# EAGLE design master-v12_36V (EAGLE 7.1.0)
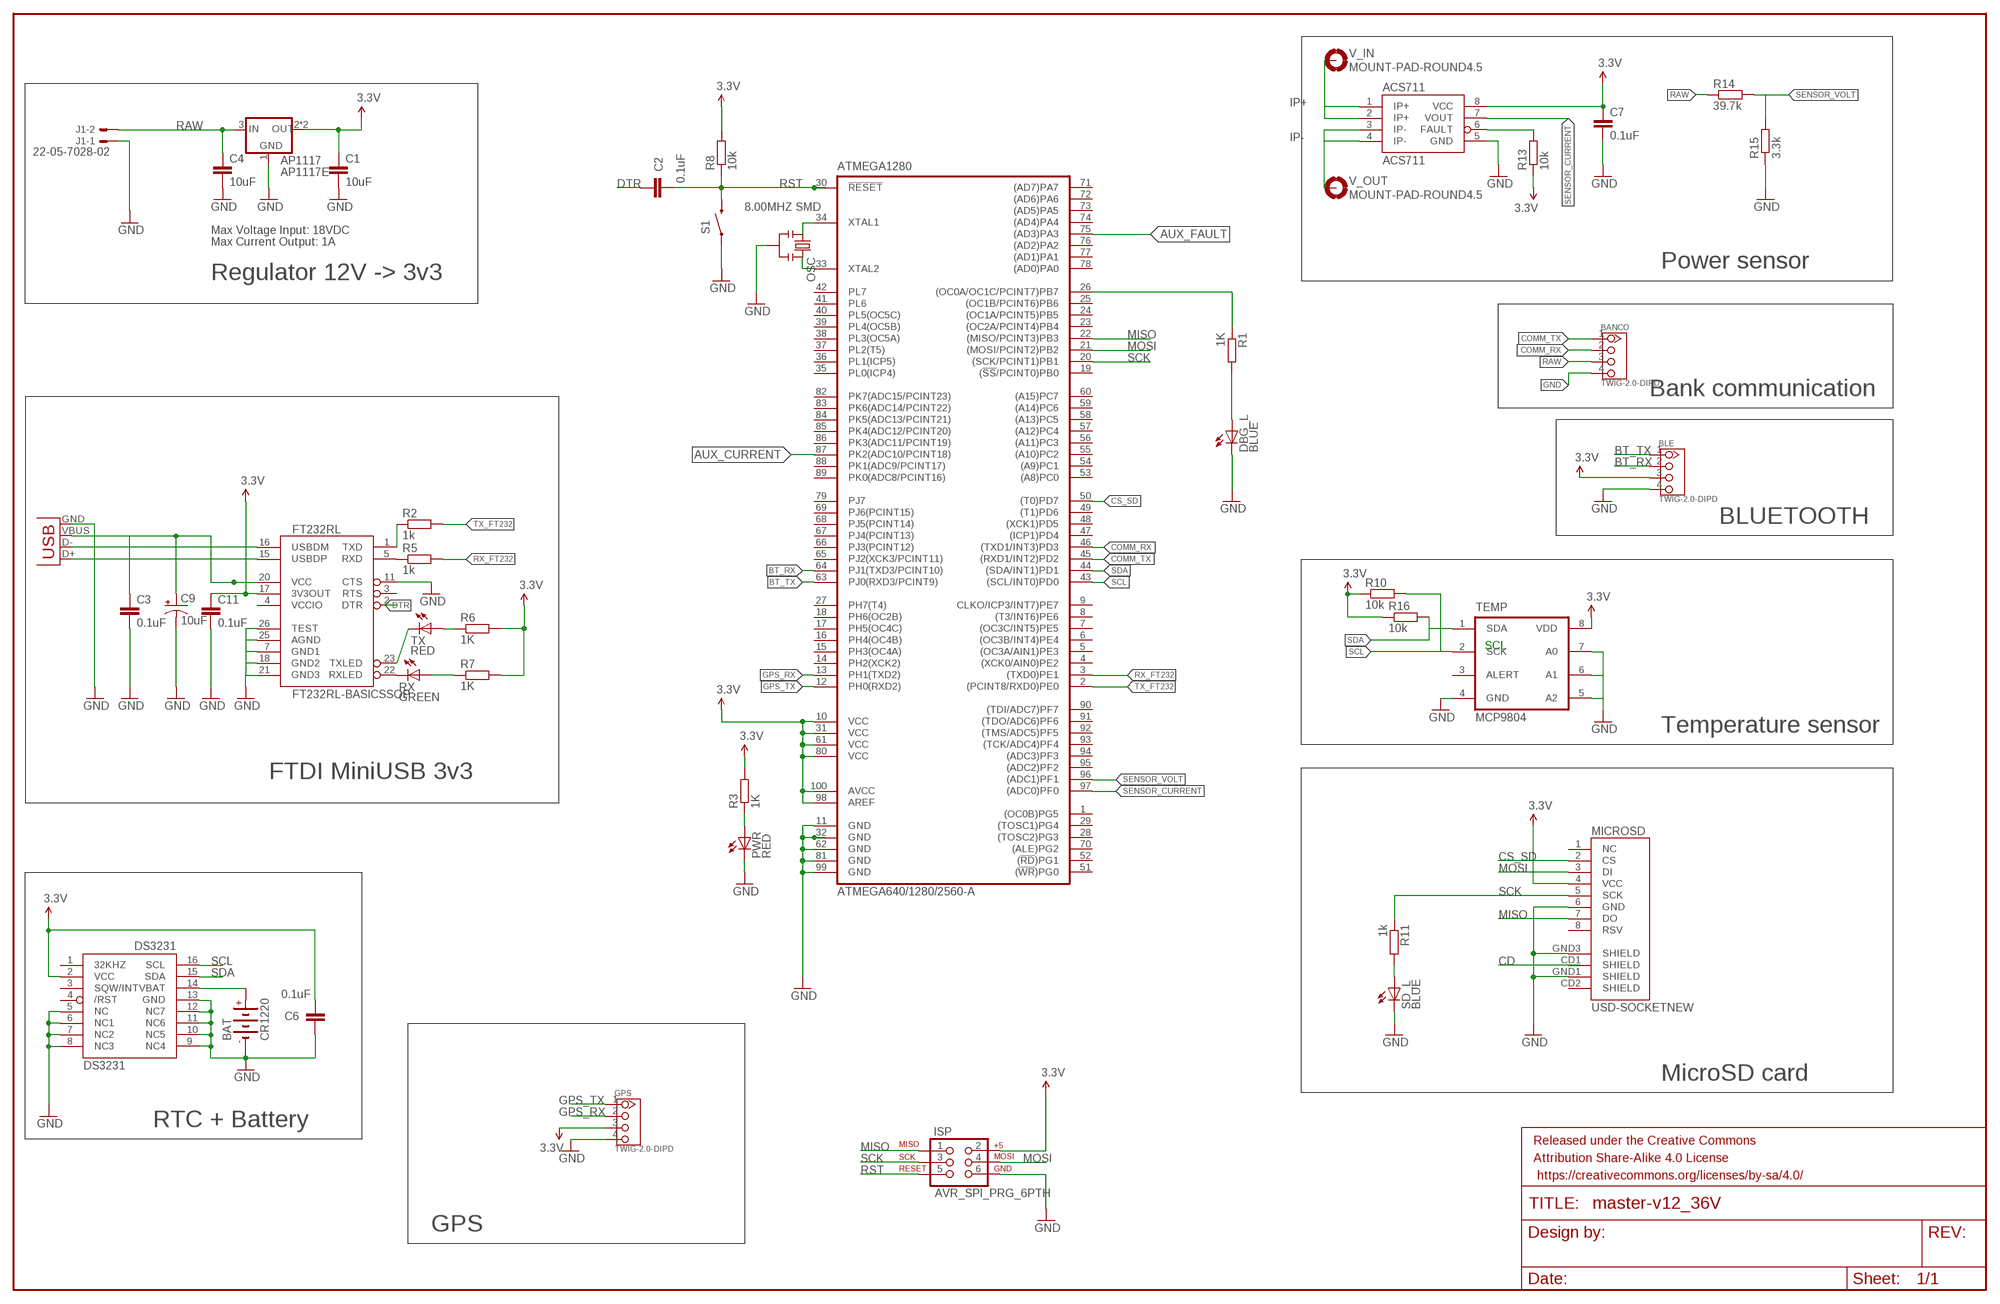
[diagram p0: schematic, sheet 1]

## Parts
ACS711  ACS711  [SOIC8]
AP1117  AP1117E  [SOT223]
ATMEGA1280  ATMEGA640/1280/2560-A  [TQFP100A]
BANCO  TWIG-2.0-DIPD  [2.0_1X4_90]
BAT  CR1220  [CR1220]
BLE  TWIG-2.0-DIPD  [2.0_1X4_90]
C1  10uF  C-EUC0805K  [C0805K]
C2  0.1uF  C-EUC0805K  [C0805K]
C3  0.1uF  CAP0402-CAP  [0402-CAP]
C4  10uF  C-EUC0805K  [C0805K]
C6  0.1uF  C-EUC0805K  [C0805K]
C7  0.1uF  C-EUC0805K  [C0805K]
C9  10uF  CAP_POL1206  [EIA3216]
C11  0.1uF  CAP0402-CAP  [0402-CAP]
DBG_L  BLUE  LEDCHIPLED_0805  [CHIPLED_0805]
DS3231  DS3231/SO  [SO16W]
FRAME1  FRAME-LEDGER  [CREATIVE_COMMONS]
FT232RL  FT232RL-BASICSSOP  [SSOP28DB]
GPS  TWIG-2.0-DIPD  [2.0_1X4_90]
ISP  AVR_SPI_PRG_6PTH  [2X3]
J1  22-05-7028-02  [7395-02]
MICROSD  USD-SOCKETNEW  [MICRO-SD-SOCKET-PP]
OSC  8.00MHZ SMD  RESONATOR-SMD  [RESONATOR-SMD]
PWR  RED  LEDCHIPLED_0805  [CHIPLED_0805]
R1  1K  R-EU_R0805  [R0805]
R2  1k  R-EU_R0805  [R0805]
R3  1K  R-EU_R0805  [R0805]
R5  1k  R-EU_R0805  [R0805]
R6  1K  R-EU_R0805  [R0805]
R7  1K  R-EU_R0805  [R0805]
R8  10k  R-EU_R0805  [R0805]
R10  10k  R-EU_R0805  [R0805]
R11  1k  R-EU_R0805  [R0805]
R13  10k  R-EU_R0805  [R0805]
R14  39.7k  R-EU_R0805  [R0805]
R15  3.3k  R-EU_R0805  [R0805]
R16  10k  R-EU_R0805  [R0805]
RX  GREEN  LEDCHIPLED_0805  [CHIPLED_0805]
S1  SWITCH-MOMENTARY-2-SMD-1101NE  [TACTILE-SWITCH-1101NE]
SD_L  BLUE  LEDCHIPLED_0805  [CHIPLED_0805]
TEMP  MCP9804  [MSOP8]
TX  RED  LEDCHIPLED_0805  [CHIPLED_0805]
V_IN  MOUNT-PAD-ROUND4.5  [4,5-PAD]
V_OUT  MOUNT-PAD-ROUND4.5  [4,5-PAD]
X1  USB-MB-H  [USB-MB-H]

## Nets
3.3V: ACS711.8(VCC) AP1117.2(OUT) AP1117.4(OUT) ATMEGA1280.10(VCC) ATMEGA1280.31(VCC) ATMEGA1280.61(VCC) ATMEGA1280.80(VCC) ATMEGA1280.98(AREF) ATMEGA1280.100(AVCC) BLE.3 C1.1 C6.1 C7.1 C11.1 DS3231.2(VCC) FT232RL.17(3V3OUT) GPS.3 ISP.2 MICROSD.4(VCC) R3.2 R6.2 R7.2 R8.2 R10.1 R13.1 R16.1 TEMP.8(VDD)
AUX_CURRENT: ATMEGA1280.87(PK2(ADC10/PCINT18))
AUX_FAULT: ATMEGA1280.75((AD3)PA3)
BT_RX: ATMEGA1280.64(PJ1(TXD3/PCINT10)) BLE.2
BT_TX: ATMEGA1280.63(PJ0(RXD3/PCINT9)) BLE.1
COMM_RX: ATMEGA1280.46((TXD1/INT3)PD3) BANCO.2
COMM_TX: ATMEGA1280.45((RXD1/INT2)PD2) BANCO.1
CS_SD: ATMEGA1280.50((T0)PD7) MICROSD.2(CS)
DTR: C2.2 FT232RL.2(DTR)
GND [power]: ACS711.5(GND) AP1117.1(GND) ATMEGA1280.11(GND) ATMEGA1280.32(GND) ATMEGA1280.62(GND) ATMEGA1280.81(GND) ATMEGA1280.99(GND) BANCO.4 BAT.- BLE.4 C1.2 C3.2 C4.2 C6.2 C7.2 C9.C(-) C11.2 DBG_L.C DS3231.5(NC) DS3231.6(NC1) DS3231.7(NC2) DS3231.8(NC3) DS3231.9(NC4) DS3231.10(NC5) DS3231.11(NC6) DS3231.12(NC7) DS3231.13(GND) FT232RL.7(GND1) FT232RL.11(CTS) FT232RL.18(GND2) FT232RL.21(GND3) FT232RL.25(AGND) FT232RL.26(TEST) GPS.4 ISP.6 J1.1 MICROSD.6(GND) MICROSD.GND1(SHIELD) MICROSD.GND3(SHIELD) OSC.2 PWR.C R15.1 S1.P$1 SD_L.C TEMP.4(GND) TEMP.5(A2) TEMP.6(A1) TEMP.7(A0) X1.GND
GPS_RX: ATMEGA1280.13(PH1(TXD2)) GPS.2
GPS_TX: ATMEGA1280.12(PH0(RXD2)) GPS.1
IP+: ACS711.1(IP+) ACS711.2(IP+) V_IN.B4,5(MOUNT)
IP-: ACS711.3(IP-) ACS711.4(IP-) V_OUT.B4,5(MOUNT)
MISO: ATMEGA1280.22((MISO/PCINT3)PB3) ISP.1 MICROSD.7(DO)
MOSI: ATMEGA1280.21((MOSI/PCINT2)PB2) ISP.4 MICROSD.3(DI)
N$1: BAT.+ DS3231.14(VBAT)
N$2: ATMEGA1280.34(XTAL1) OSC.1
N$3: DBG_L.A R1.2
N$4: ATMEGA1280.26((OC0A/OC1C/PCINT7)PB7) R1.1
N$6: FT232RL.1(TXD) R2.1
N$7: PWR.A R3.1
N$8: FT232RL.5(RXD) R5.1
N$10: FT232RL.22(RXLED) RX.C
N$11: R7.1 RX.A
N$12: FT232RL.23(TXLED) TX.C
N$13: R6.1 TX.A
N$14: ATMEGA1280.33(XTAL2) OSC.3
N$23: R11.2 SD_L.A
N$69: ACS711.6(FAULT) R13.2
RAW [power]: AP1117.3(IN) BANCO.3 C4.1 J1.2 R14.1
RST: ATMEGA1280.30(!RESET!) C2.1 ISP.5 R8.1 S1.P$2
RX_FT232: ATMEGA1280.3((TXD0)PE1) R5.2
SCK: ATMEGA1280.20((SCK/PCINT1)PB1) ISP.3 MICROSD.5(SCK) R11.1
SCL: ATMEGA1280.43((SCL/INT0)PD0) DS3231.16(SCL) R10.2 TEMP.2(SCK)
SDA: ATMEGA1280.44((SDA/INT1)PD1) DS3231.15(SDA) R16.2 TEMP.1(SDA)
SENSOR_CURRENT: ACS711.7(VOUT) ATMEGA1280.97((ADC0)PF0)
SENSOR_VOLT: ATMEGA1280.96((ADC1)PF1) R14.2 R15.2
TX_FT232: ATMEGA1280.2((PCINT8/RXD0)PE0) R2.2
USB_D+1: FT232RL.15(USBDP) X1.D+
USB_D-1: FT232RL.16(USBDM) X1.D-
VCC1 [power]: C3.1 C9.A(+) FT232RL.20(VCC) X1.VBUS
Unconnected: ATMEGA1280.1((OC0B)PG5) ATMEGA1280.4((XCK0/AIN0)PE2) ATMEGA1280.5((OC3A/AIN1)PE3) ATMEGA1280.6((OC3B/INT4)PE4) ATMEGA1280.7((OC3C/INT5)PE5) ATMEGA1280.8((T3/INT6)PE6) ATMEGA1280.9(CLKO/ICP3/INT7)PE7) ATMEGA1280.14(PH2(XCK2)) ATMEGA1280.15(PH3(OC4A)) ATMEGA1280.16(PH4(OC4B)) ATMEGA1280.17(PH5(OC4C)) ATMEGA1280.18(PH6(OC2B)) ATMEGA1280.19((!SS!/PCINT0)PB0) ATMEGA1280.23((OC2A/PCINT4)PB4) ATMEGA1280.24((OC1A/PCINT5)PB5) ATMEGA1280.25((OC1B/PCINT6)PB6) ATMEGA1280.27(PH7(T4)) ATMEGA1280.28((TOSC2)PG3) ATMEGA1280.29((TOSC1)PG4) ATMEGA1280.35(PL0(ICP4)) ATMEGA1280.36(PL1(ICP5)) ATMEGA1280.37(PL2(T5)) ATMEGA1280.38(PL3(OC5A)) ATMEGA1280.39(PL4(OC5B)) ATMEGA1280.40(PL5(OC5C)) ATMEGA1280.41(PL6) ATMEGA1280.42(PL7) ATMEGA1280.47((ICP1)PD4) ATMEGA1280.48((XCK1)PD5) ATMEGA1280.49((T1)PD6) ATMEGA1280.51((!WR!)PG0) ATMEGA1280.52((!RD!)PG1) ATMEGA1280.53((A8)PC0) ATMEGA1280.54((A9)PC1) ATMEGA1280.55((A10)PC2) ATMEGA1280.56((A11)PC3) ATMEGA1280.57((A12)PC4) ATMEGA1280.58((A13)PC5) ATMEGA1280.59((A14)PC6) ATMEGA1280.60((A15)PC7) ATMEGA1280.65(PJ2(XCK3/PCINT11)) ATMEGA1280.66(PJ3(PCINT12)) ATMEGA1280.67(PJ4(PCINT13)) ATMEGA1280.68(PJ5(PCINT14)) ATMEGA1280.69(PJ6(PCINT15)) ATMEGA1280.70((ALE)PG2) ATMEGA1280.71((AD7)PA7) ATMEGA1280.72((AD6)PA6) ATMEGA1280.73((AD5)PA5) ATMEGA1280.74((AD4)PA4) ATMEGA1280.76((AD2)PA2) ATMEGA1280.77((AD1)PA1) ATMEGA1280.78((AD0)PA0) ATMEGA1280.79(PJ7) ATMEGA1280.82(PK7(ADC15/PCINT23)) ATMEGA1280.83(PK6(ADC14/PCINT22)) ATMEGA1280.84(PK5(ADC13/PCINT21)) ATMEGA1280.85(PK4(ADC12/PCINT20)) ATMEGA1280.86(PK3(ADC11/PCINT19)) ATMEGA1280.88(PK1(ADC9/PCINT17)) ATMEGA1280.89(PK0(ADC8/PCINT16)) ATMEGA1280.90((TDI/ADC7)PF7) ATMEGA1280.91((TDO/ADC6)PF6) ATMEGA1280.92((TMS/ADC5)PF5) ATMEGA1280.93((TCK/ADC4)PF4) ATMEGA1280.94((ADC3)PF3) ATMEGA1280.95((ADC2)PF2) DS3231.1(32KHZ) DS3231.3(SQW/INT) DS3231.4(/RST) FT232RL.3(RTS) MICROSD.1(NC) MICROSD.8(RSV) MICROSD.CD1(SHIELD) MICROSD.CD2(SHIELD) TEMP.3(ALERT)

## Notes on the sheet
- Max Voltage Input: 18VDC
- Max Current Output: 1A
- Power sensor
- Regulator 12V -> 3v3
- Bank communication
- BLUETOOTH
- SCL
- Temperature sensor
- FTDI MiniUSB 3v3
- MicroSD card
- RTC + Battery
- GPS

## Power pins joined to a net without a drawn wire
VCCIO: FT232RL.4(VCCIO)

## Library data of the parts
ACS711 = ACS711:ACS711: Hall-effect-based isolated linear current sensor
AP1117 = v-reg:AP1117: LDO Regulator
ATMEGA1280 = atmel-avr:ATMEGA640/1280/2560: MICROCONTROLLER 64K/128K/256K Flash 8K Bytes Internal SRAM 4K Bytes EEPROM
BANCO BLE GPS = Grove :TWIG-2.0-DIP
BAT = battery:CR1220: LI BATTERY Panasonic
C1 C2 C4 C6 C7 = rcl:C-EU: CAPACITOR, European symbol
C3 C11 = SparkFun:CAP: Capacitor Standard 0603 ceramic capacitor, and 0.1" leaded capacitor.
C9 = SparkFun:CAP_POL: Capacitor Polarized These are standard SMD and PTH capacitors. Normally 10uF, 47uF, and 100uF in electrolytic and tantalum varieties. Always verify the external diameter of the through hole cap, it varies with capacity, voltage, and manufacturer. The EIA devices should be standard.
DBG_L PWR RX SD_L TX = adafruit:LED: LED OSRAM: - CHIPLED LG R971, LG N971, LY N971, LG Q971, LY Q971, LO R971, LY R971 LH N974, LH R974 LS Q976, LO Q976, LY Q976 LO Q996 - Hyper CHIPLED LW Q18S LB Q993, LB Q99A, LB R99A - SideLED LS A670, LO A670, LY A670, LG A670, LP A670 LB A673, LV A673, LT A673, LW A673 LH A674 LY A675 LS A676, LA A676, LO A676, LY A676, LW A676 LS A679, LY A679, LG A679 - Hyper Micro SIDELED® LS Y876, LA Y876, LO Y876, LY Y876 LT Y87S - SmartLED LW L88C, LW L88S LB L89C, LB L89S, LG L890 LS L89K, LO L89K, LY L89K LS L896, LA L896, LO L896, LY L896 - TOPLED LS T670, LO T670, LY T670, LG T670, LP T670 LSG T670, LSP T670, LSY T670, LOP T670, LYG T670 LG T671, LOG T671, LSG T671 LB T673, LV T673, LT T673, LW T673 LH T674 LS T676, LA T676, LO T676, LY T676, LB T676, LH T676, LSB T676, LW T676 LB T67C, LV T67C, LT T67C, LS T67K, LO T67K, LY T67K, LW E67C LS E67B, LA E67B, LO E67B, LY E67B, LB E67C, LV E67C, LT E67C LW T67C LS T679, LY T679, LG T679 LS T770, LO T770, LY T770, LG T770, LP T770 LB T773, LV T773, LT T773, LW T773 LH T774 LS E675, LA E675, LY E675, LS T675 LS T776, LA T776, LO T776, LY T776, LB T776 LHGB T686 LT T68C, LB T68C - Hyper Mini TOPLED® LB M676 - Mini TOPLED Santana® LG M470 LS M47K, LO M47K, LY M47K Source: http://www.osram.convergy.de/
DS3231 = adafruit:DS3231
FRAME1 = SparkFun-Aesthetics:FRAME-LEDGER: Schematic Frame Standard 11x14 US Ledger frame
FT232RL = SparkFun-DigitalIC:FT232RL-BASIC: USB UART This is the simplified version of the FT232RL unit. Only what you need, nothing you don't. Spark Fun Electronics SKU : COM-00650
ISP = SparkFun-Connectors:AVR_SPI_PRG_6: AVR ISP 6 Pin This is the reduced ISP connector for AVR programming. Common on Arduino. This footprint will take up less PCB space and can be used with a 10-pin to 6-pin adapter such as SKU: BOB-08508
J1 = con-molex:22-?-02: CONNECTOR wire to board 2.54 mm (.1 inch) pitch header; OC_FARNELL: 9731601; OC_NEWARK: unknown
MICROSD = SparkFun-Connectors:USD-SOCKET: microSD Socket Push-push type uSD socket. Schematic element and footprint production proven. Spark Fun Electronics SKU : PRT-00127. tDoc lines correctly indicate media card edge positions when inserting (unlocked, locked, depressed).
OSC = resonador:RESONATOR-: Resonator Small SMD resonator. This is the itty bitty 10/20MHz resonators with built in caps. CSTCE10M0G55 and CSTCE20M0V53. Footprint has been reviewed closely but hasn't been tested yet.
R1-R3 R5-R8 R10 R11 R13-R16 = rcl:R-EU_: RESISTOR, European symbol
S1 = SparkFun-Electromechanical:SWITCH-MOMENTARY-2: Various NO switches- pushbuttons, reed, etc
TEMP = MCP9804:MCP9804: TEMP SENSOR
V_IN V_OUT = holes:MOUNT-PAD-ROUND: MOUNTING PAD, round
X1 = SparkFun:USB: USB Connectors USB-B-PTH is fully proven SKU : PRT-00139 USB-miniB is fully proven SKU : PRT-00587 USB-A-PCB is untested. USB-A-H is throughly reviewed, but untested. Spark Fun Electronics SKU : PRT-00437 USB-B-SMT is throughly reviewed, but untested. Needs silkscreen touching up. USB-A-S has not been used/tested USB-MB-H has not been used/tested

## Net classes
0 default: width 0.203 mm
1 power: width 0.254 mm

## Board
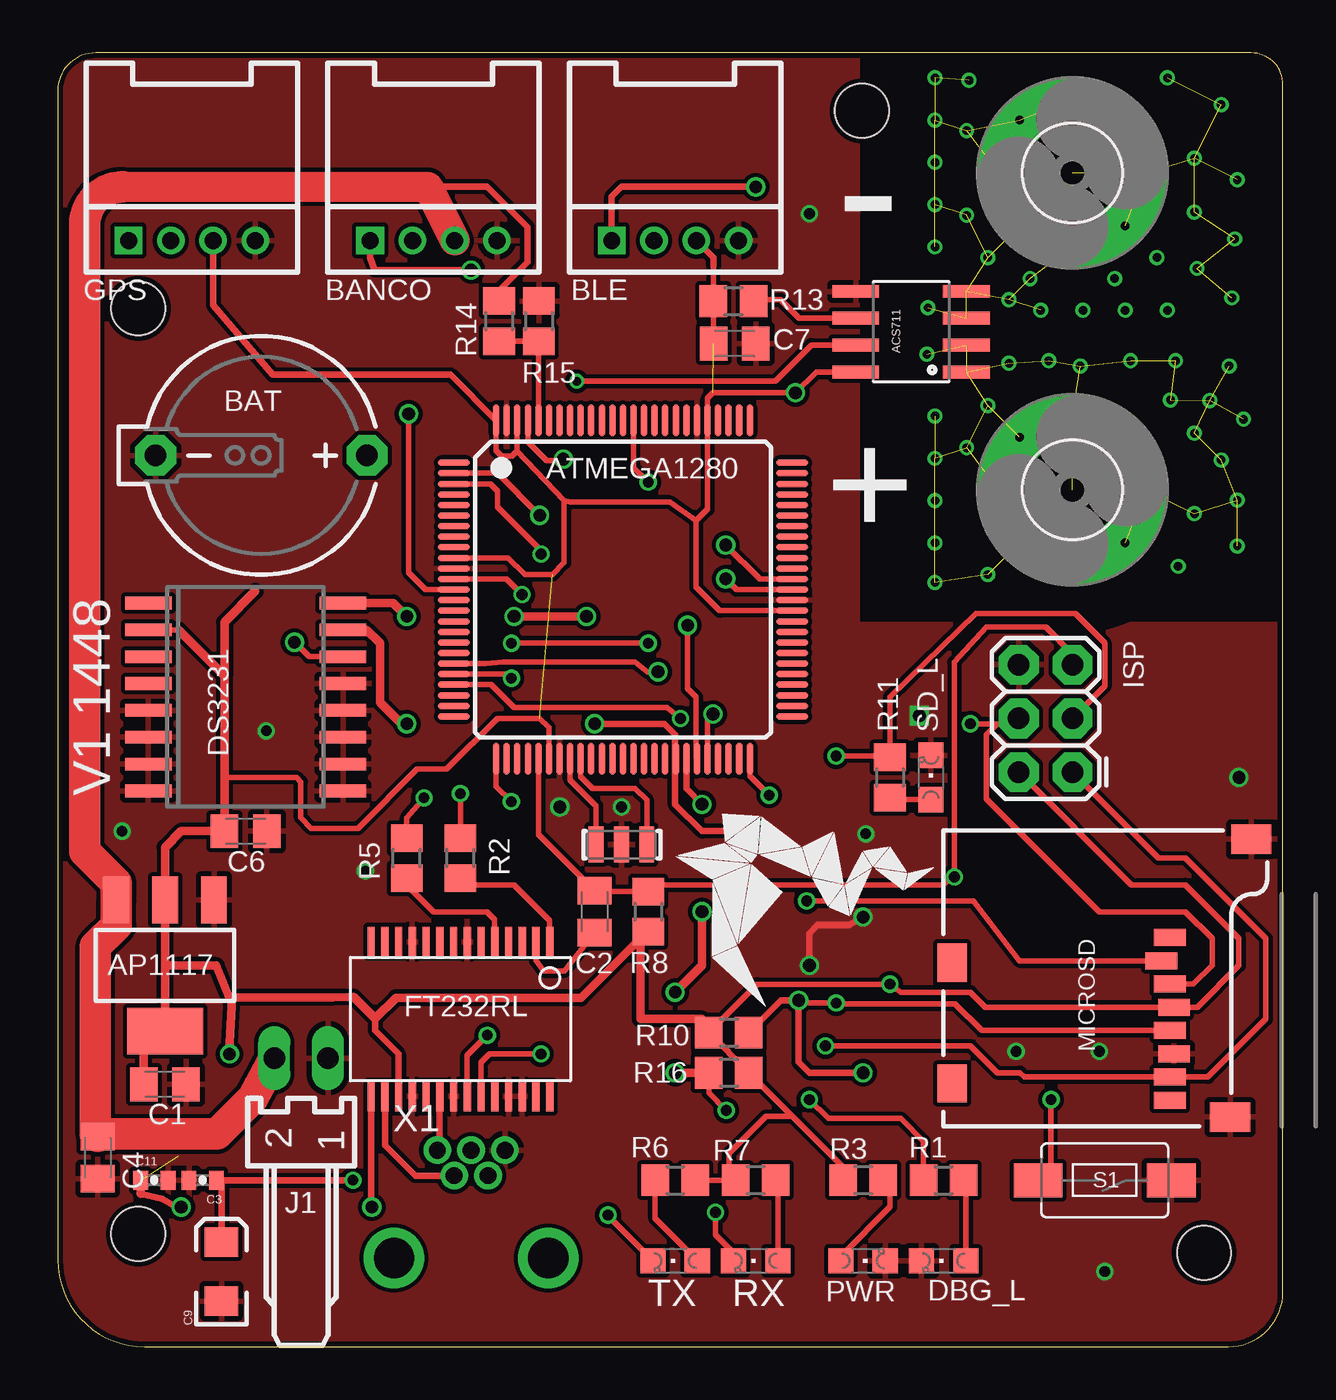
[diagram p1: board, top side]
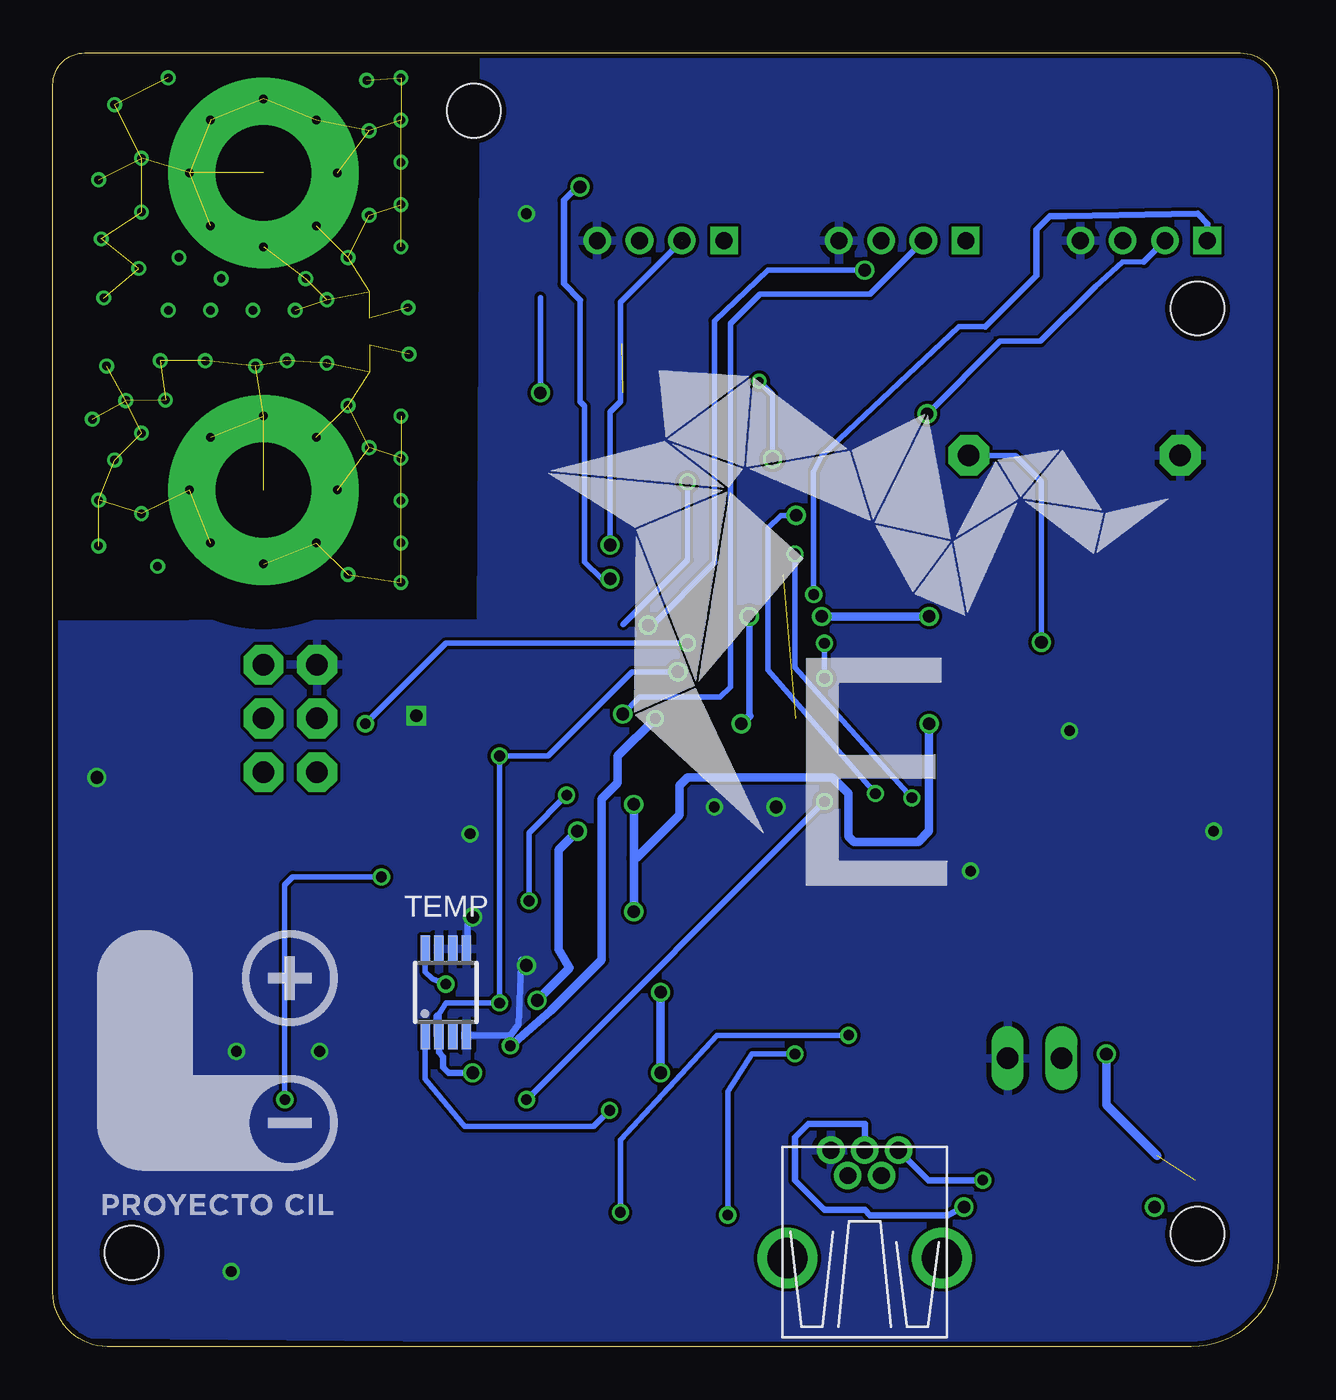
[diagram p2: board, bottom side, seen from below]

Size 57.96 x 61.2 mm. Coordinates in mm from the lower left corner, seen from the top.
Outline: 0,59.41 0,4.1 arc90 4.1,0 55.38,0 arc90 57.96,2.58 57.96,59.7 arc90 56.46,61.2 1.79,61.2 arc90 0,59.41
Copper layers (1*16): Top 0.035mm / dielectric 1.5mm / Bottom 0.035mm
Design rules "ITEADstudio_DRC": minimum track width 6mil, minimum drill 12mil, track to track 6mil, track to pad 6mil, pad to pad 6mil, via to via 6mil, smd to smd 0mil, copper to edge 10mil, drill to drill 10mil, minimum pad ring 10mil, minimum via ring 6mil, stop-mask expansion 2mil, vias tented up to drill 100mil, thermal gap 10mil
Holes 2.54 mm at 3.81,49.11 54.23,4.45 38.05,58.46 3.81,5.33

### Footprints (pad centres in the part's own frame; a part is rotated, then mirrored left to right if it is on the bottom)
SOIC8 = smd 0.61 x 2.21: 1 -1.905,-2.616; 2 -0.635,-2.616; 3 0.635,-2.616; 4 1.905,-2.616; 5 1.905,2.616; 6 0.635,2.616; 7 -0.635,2.616; 8 -1.905,2.616
SOT223 = smd 1.219 x 2.235: 1 -2.311,-3.099; 2 0,-3.099; 3 2.311,-3.099 | smd 3.6 x 2.2: 4 0,3.099
TQFP100A = smd 1.5 x 0.3: 1 -8,6; 2 -8,5.5; 3 -8,5; 4 -8,4.5; 5 -8,4; 6 -8,3.5; 7 -8,3; 8 -8,2.5; 9 -8,2; 10 -8,1.5; 11 -8,1; 12 -8,0.5; 13 -8,0; 14 -8,-0.5; 15 -8,-1; 16 -8,-1.5; 17 -8,-2; 18 -8,-2.5; 19 -8,-3; 20 -8,-3.5; 21 -8,-4; 22 -8,-4.5; 23 -8,-5; 24 -8,-5.5; 25 -8,-6; 51 8,-6; 52 8,-5.5; 53 8,-5; 54 8,-4.5; 55 8,-4; 56 8,-3.5; 57 8,-3; 58 8,-2.5; 59 8,-2; 60 8,-1.5; 61 8,-1; 62 8,-0.5; 63 8,0; 64 8,0.5; 65 8,1; 66 8,1.5; 67 8,2; 68 8,2.5; 69 8,3; 70 8,3.5; 71 8,4; 72 8,4.5; 73 8,5; 74 8,5.5; 75 8,6 | smd 0.3 x 1.5: 26 -6,-8; 27 -5.5,-8; 28 -5,-8; 29 -4.5,-8; 30 -4,-8; 31 -3.5,-8; 32 -3,-8; 33 -2.5,-8; 34 -2,-8; 35 -1.5,-8; 36 -1,-8; 37 -0.5,-8; 38 0,-8; 39 0.5,-8; 40 1,-8; 41 1.5,-8; 42 2,-8; 43 2.5,-8; 44 3,-8; 45 3.5,-8; 46 4,-8; 47 4.5,-8; 48 5,-8; 49 5.5,-8; 50 6,-8; 76 6,8; 77 5.5,8; 78 5,8; 79 4.5,8; 80 4,8; 81 3.5,8; 82 3,8; 83 2.5,8; 84 2,8; 85 1.5,8; 86 1,8; 87 0.5,8; 88 0,8; 89 -0.5,8; 90 -1,8; 91 -1.5,8; 92 -2,8; 93 -2.5,8; 94 -3,8; 95 -3.5,8; 96 -4,8; 97 -4.5,8; 98 -5,8; 99 -5.5,8; 100 -6,8
2.0_1X4_90 = drill 0.8 pad 1.27 square: 1 -3,0 | drill 0.8 pad 1.27: 2 -1,0; 3 1,0; 4 3,0
CR1220 = drill 1.016 pad 1.93 octagon: + -5,0; - 5,0
C0805K = smd 1.3 x 1.6: 1 -1,0; 2 1,0
0402-CAP = smd 0.7 x 0.9: 1 -0.65,0; 2 0.65,0
EIA3216 = smd 1.4 x 1.6: A 1.4,0; C -1.4,0
CHIPLED_0805 = smd 1.2 x 1.2: A 0,-1.05; C 0,1.05
SO16W = smd 0.6 x 2.2: 1 -4.445,-4.6; 2 -3.175,-4.6; 3 -1.905,-4.6; 4 -0.635,-4.6; 5 0.635,-4.6; 6 1.905,-4.6; 7 3.175,-4.6; 8 4.445,-4.6; 9 4.445,4.6; 10 3.175,4.6; 11 1.905,4.6; 12 0.635,4.6; 13 -0.635,4.6; 14 -1.905,4.6; 15 -3.175,4.6; 16 -4.445,4.6
SSOP28DB = smd 0.348 x 1.397: 1 -4.225,-3.656; 2 -3.575,-3.656; 3 -2.925,-3.656; 4 -2.275,-3.656; 5 -1.625,-3.656; 6 -0.975,-3.656; 7 -0.325,-3.656; 8 0.325,-3.656; 9 0.975,-3.656; 10 1.625,-3.656; 11 2.275,-3.656; 12 2.925,-3.656; 13 3.575,-3.656; 14 4.225,-3.656; 15 4.225,3.656; 16 3.575,3.656; 17 2.925,3.656; 18 2.275,3.656; 19 1.625,3.656; 20 0.975,3.656; 21 0.325,3.656; 22 -0.325,3.656; 23 -0.975,3.656; 24 -1.625,3.656; 25 -2.275,3.656; 26 -2.925,3.656; 27 -3.575,3.656; 28 -4.225,3.656
2X3 = drill 1.016 pad 1.88 octagon: 1 0,0; 2 0,2.54; 3 2.54,0; 4 2.54,2.54; 5 5.08,0; 6 5.08,2.54
7395-02 = drill 1.016 long: 1 1.27,0; 2 -1.27,0
MICRO-SD-SOCKET-PP = smd 0.8 x 1.5: 1 -8.94,10.7; 2 -7.84,10.3; 3 -6.74,10.7; 4 -5.64,10.9; 5 -4.54,10.7; 6 -3.44,10.9; 7 -2.34,10.7; 8 -1.24,10.7 | smd 1.8 x 1.4: CD1 -2.05,0.4; CD2 -7.75,0.4 | smd 1.4 x 1.9: GND1 -13.6,14.55; GND3 -0.45,13.55
RESONATOR-SMD = smd 0.7 x 1.7: 1 -1.2,0; 2 0,0; 3 1.2,0
R0805 = smd 1.3 x 1.5: 1 -0.95,0; 2 0.95,0
TACTILE-SWITCH-1101NE = smd 2.3 x 1.6: P$1 -3.15,0; P$2 3.15,0
MSOP8 = smd 0.45 x 1.3: 1 -0.975,-2.05; 2 -0.325,-2.05; 3 0.325,-2.05; 4 0.975,-2.05; 5 0.975,2.05; 6 0.325,2.05; 7 -0.325,2.05; 8 -0.975,2.05
4,5-PAD = drill 4.5 pad 9: B4,5 0,0
USB-MB-H = drill 0.8: D+ 5.1,0; D- 3.9,0.8; GND 5.1,-1.6; ID 3.9,-0.8; VBUS 5.1,1.6 | drill 1.9: P$6 0,-3.65; P$7 0,3.65

### Placement (x,y rotation side)
ACS711  40.37,48.01 90 top
AP1117  5.08,18.03 180 top
ATMEGA1280  26.74,35.81 0 top
BANCO  17.78,52.32 0 top
BAT  9.63,42.16 180 top
BLE  29.21,52.32 0 top
C1  5.07,12.41 0 top
C2  25.4,20.57 270 top
C3  6.86,7.87 180 top
C4  1.9,8.94 270 top
C6  8.89,24.38 0 top
C7  32.03,47.45 0 top
C9  7.75,3.56 90 top
C11  4.57,7.87 0 top
DBG_L  41.91,4.06 90 top
DS3231  8.89,30.73 270 top
FRAME1  7.62,-12.45 0 top  (outside the outline)
FT232RL  19.05,15.49 180 top
GPS  6.35,52.32 0 top
ISP  48.01,27.18 90 top
J1  11.52,13.64 0 top
MICROSD  41.91,10.41 270 top
OSC  26.67,23.75 180 top
PWR  38.1,4.06 270 top
R1  41.91,7.87 0 top
R2  19.05,23.11 90 top
R3  38.1,7.87 180 top
R5  16.51,23.11 90 top
R6  29.21,7.87 0 top
R7  33.02,7.87 180 top
R8  27.94,20.57 270 top
R10  31.75,14.86 0 top
R11  39.37,26.92 270 top
R13  31.97,49.45 0 top
R14  20.88,48.51 270 top
R15  22.76,48.51 270 top
R16  31.75,12.95 180 top
RX  33.02,4.06 90 top
S1  49.53,7.87 180 top
SD_L  41.31,26.92 0 top
TEMP  39.37,16.76 0 bottom
TX  29.21,4.06 90 top
U$1  [LOGO_CIL]  57.78,5.33 0 bottom
U$2  [LOGO_ELIBATT]  34.92,18.54 0 bottom
U$4  [LOGO_ELIBATT2]  29.08,15.75 0 top
V_IN  48,40.52 0 top
V_OUT  48,55.52 0 top
X1  19.56,4.19 90 top

### Tracks (layer width: path | path; a pad name or v marks a point on that pad's centre or on a via)
3.3V  (via drill 0.51, 0.6)  (3 unrouted)
  Top 0.254: R6.2 R7.2 31.75,8.45 31.75,9.14 33.49,10.89 34.77,10.89 | R10.1 R16.1 34.77,10.89 | 5.08,21.57 AP1117.2 | 45.65,16.05 MICROSD.4 | MICROSD.4 43.89,16.05 43.18,16.76 39.88,16.76 v39.37,17.14 33.09,17.14 R10.1 | ATMEGA1280.10 21.31,37.31 22.1,36.52 23.4,36.52 23.96,37.08 23.96,40.02 | 5.71,33.91 DS3231.2 | ATMEGA1280.100 20.74,42.38 21,42.12 21.5,42.12 21.74,42.36 | 21.74,42.36 ATMEGA1280.98 | 21.74,42.36 23.96,40.02 | 23.96,40.02 24.27,39.94 28.96,39.94 30.2,39.08 | ATMEGA1280.61 31.31,34.81 30.2,35.92 30.2,39.08 | ATMEGA1280.31 23.24,29.28 22.8,29.72 20.8,29.72 18.4,27.32 17,27.32 14.2,24.52 12,24.52 11.5,25.02 11.5,26.72 11.3,26.92 7.89,26.92 | 48.19,16.05 MICROSD.4 | ISP.2 50.8,21.84 53.34,21.84 55.88,19.3 55.88,18.03 53.9,16.05 MICROSD.4 | 30.2,39.08 30.74,39.62 ATMEGA1280.80 30.74,44.86 31,45.12 v34.9,45.12 35.88,46.11 ACS711.8 | 34.77,10.89 37.15,8.5 R3.2 | 30.48,15.49 R10.1 | R13.1 C7.1 31.03,51.14 | 27.88,19.62 R8.2
  Top 0.305: 15.02,15.52 15.02,14.96 16.12,13.85 FT232RL.17 | 3.94,7.24 4.95,6.98 5.59,6.6 v5.84,6.6 | GPS.3 7.37,49.28 10.16,45.97 18.58,45.97 ATMEGA1280.100 | 31.03,51.14 31.03,51.5 BLE.3
  Top 0.381: 24.75,16.49 27.56,19.3 27.88,19.62
  Top 0.4: 7.89,31.73 7.89,26.92 C6.1 5.84,24.38 5.08,23.62 AP1117.2 5.08,18.02 | 7.89,31.73 5.71,33.91 | 5.08,18.02 AP1117.4 4.07,13.92 C1.1 | 24.75,16.49 24.18,16.49 16,16.51 15.02,15.52 14,16.54 13,16.52 8.26,16.52 8.11,16.52 7.5,18.02 5.08,18.02 | 7.89,31.73 7.89,34.27 9.35,35.73
  Top 0.406: 30.48,15.49 27.56,15.49 27.56,19.3 | C11.1 3.92,7.61 3.94,7.24 | v8.13,13.84 8.13,14.37 8.26,16.52
  Bottom 0.254: v34.9,45.12 34.9,49.63 | TEMP.8 40.34,17.74 40.01,17.4 v39.37,17.14
  Bottom 0.406: 5.71,9.02 8.13,11.43 v8.13,13.84
AUX_CURRENT  (via drill 0.51)
  Top 0.254: v27.94,40.89 27.24,41.59 ATMEGA1280.87
  Bottom 0.254: 30.99,34.16 27.94,37.21 v27.94,40.89
BT_RX  (via drill 0.6)  (1 unrouted)
  Top 0.254: 34.54,36.31 ATMEGA1280.64 33.21,36.31 v31.6,37.92
  Bottom 0.254: 28.21,52.31 31.11,49.4 31.11,44.7 31.6,44.22 v31.6,37.92
BT_TX  (via drill 0.6)
  Top 0.254: v31.6,36.32 32.11,35.81 ATMEGA1280.63
  Top 0.305: BLE.1 26.21,54.4 26.67,54.86 v33.02,54.86
  Bottom 0.254: 33.02,49.51 33.02,44.7 32.8,44.48 32.8,37.12 32,36.32 v31.6,36.32
  Bottom 0.305: v33.02,54.86 33.15,54.86 33.78,54.23 33.78,50.28 33.02,49.51
COMM_RX  (via drill 0.6)
  Top 0.254: v31,29.92 30.74,29.66 ATMEGA1280.46
  Bottom 0.254: BANCO.2 19.32,49.78 24.51,49.78 25.91,48.39 25.91,31.22 26.4,30.72 30.2,30.72 v31,29.92
COMM_TX  (via drill 0.6)
  Top 0.254: v29.8,34.12 29.8,31.12 30.2,30.72 30.2,27.85 ATMEGA1280.45
  Top 0.305: BANCO.1 14.78,51.51 14.99,50.93 v19.56,50.93
  Bottom 0.254: 19.92,50.93 24.13,50.93 26.67,48.51 26.67,37.08 29.63,34.12 v29.8,34.12
  Bottom 0.305: 19.92,50.93 v19.56,50.93
CS_SD  (via drill 0.51)
  Top 0.254: v33.66,26.09 32.74,27 ATMEGA1280.50 | MICROSD.2 45.5,18.25 43.31,21.08 v35.43,21.08
  Bottom 0.254: v33.66,26.09 35.43,24.31 v35.43,21.08
DTR
  Top 0.254: FT232RL.2 22.62,18.27 22.99,17.78 23.99,17.78 C2.2
GND  (via drill 0.5, 0.51, 0.6)
  Top 0.305: v35.56,18.03 35.56,19.56 35.94,19.94 37.47,19.94 v38.1,20.32
  Bottom 0.305: TEMP.4 38.38,14.73 36.32,14.73 35.94,15.24 35.81,18.03 | 35.81,18.29 35.81,18.03 | 35.81,18.03 v35.56,18.03 | v38.1,20.32 38.1,20.19 38.35,19.94 38.35,18.86 TEMP.5
  other vias: 9.87,29.13 3.05,24.38 14.55,22.5 38.23,24.26 49.53,3.56 49.28,13.97 45.34,13.97 26.67,25.53 35.56,53.59 40.77,29.85 23.75,25.53 55.88,26.92
  pour Bottom: 58.42,34.16 58.28,-0.31 arc-89 57.92,0.59 0.09,0.08 arc-90 -0.13,-0.97 -0.13,58.86 arc-90 2.35,61.23 37.57,61.03 37.69,34.24
  pour Top (isolate 0.2): 58.42,34.16 58.42,0.25 0,0.25 0,59.11 arc-90 2.1,61.21 37.82,61.21 37.82,34.16
GPS_RX  (via drill 0.6)
  Top 0.254: 18.8,35.81 ATMEGA1280.13 17.4,35.82 16.6,36.62 v16.6,44.12
  Bottom 0.254: 6.35,51.32 7.37,51.31 8.65,50.15 11.24,47.56 13.16,47.56 v16.6,44.12
  Bottom 0.305: 6.35,51.32 GPS.2
GPS_TX  (via drill 0.51)
  Top 0.254: v21.97,35.58 21.23,36.31 ATMEGA1280.12
  Bottom 0.254: 13.84,48.26 15.11,48.26 21.59,42.16 21.97,41.4 v21.97,35.58
  Bottom 0.305: GPS.1 3.35,53.13 3.81,53.59 10.03,53.47 10.79,53.47 11.43,52.83 11.43,50.67 13.84,48.26
IP+  (via drill 0.4)  (33 unrouted)
  other vias: 45,46.52 46.88,46.64 48.37,46.39 50.75,46.64 52.88,46.64 55.42,46.39 53.77,43.21 53.77,39.4 55.8,37.88 55.04,41.94 55.8,40.04 52.63,44.78 54.51,44.76 56.1,43.87 44,44.52 41.5,44.02 41.5,42.02 43,42.52 41.12,46.95 41.5,40.02 41.5,38.02 41.5,36.15 44,36.52 45.5,38.02 44.5,40.52 45.5,43.02 48,44.02 50.5,43.02 51.5,40.52 50.5,38.02 48,37.02
IP-  (via drill 0.4)  (31 unrouted)
  other vias: 41.5,60.02 43.11,59.91 41.5,58.02 43,57.52 43,57.52 41.5,56.02 43,53.52 41.5,54.02 41.5,52.02 41.17,49.15 44,51.52 45.5,53.02 46,50.52 45,49.52 46.5,49.02 48,52.02 44.5,55.52 45.5,58.02 48,59.02 50.5,58.02 51.5,55.52 50.5,53.02 52.5,60.02 55.04,58.75 53.77,56.21 53.77,53.67 53.9,51.01 55.55,49.61 55.67,52.4 55.8,55.2
MISO  (via drill 0.51)
  Top 0.254: ATMEGA1280.22 20.5,31.31 21.59,30.23 28.83,30.23 v29.46,29.72 | v36.32,14.22 43.18,14.22 44.45,12.95 45.52,12.95 45.72,12.75 MICROSD.7 54.41,12.75 57.15,15.49 57.15,19.3 53.34,23.11 52.07,23.11 ISP.1
  Bottom 0.406: v36.32,14.22 34.42,15.88 32,18.29 32,25.91 31.24,26.67 31.24,27.94 v29.46,29.72
MOSI  (via drill 0.51)
  Top 0.254: ATMEGA1280.21 19.05,31.81 | ATMEGA1280.21 | MICROSD.3 53.73,17.15 54.61,18.03 54.61,19.3 53.34,20.57 49.28,20.57 43.94,25.91 43.94,28.96 44.45,29.46 | 44.45,29.46 45.21,29.46 ISP.4 | 44.45,29.46 v43.18,29.46 | v27.94,33.27 v21.46,33.27 | ATMEGA1280.21 21.53,31.81 21.46,31.88 v21.46,31.62
  Bottom 0.254: v43.18,29.46 39.37,33.27 v27.94,33.27 | v21.46,33.27 v21.46,31.62
N$1  (via drill 0.6)
  Top 0.254: v11.2,33.32 11.88,32.64 DS3231.14
  Bottom 0.254: BAT.+ 12.44,42.16 11.2,40.92 v11.2,33.32
N$2
  Top 0.254: ATMEGA1280.34 24.74,26.98 25.31,26.42 27.3,26.42 27.87,25.85 OSC.1
N$3
  Top 0.254: R1.2 42.96,7.77 DBG_L.A
N$4  (via drill 0.51)
  Top 0.254: ATMEGA1280.26 20.74,26.5 v21.46,25.78 | v35.56,11.68 36.45,10.79 39.88,10.79 40.96,9.71 R1.1
  Bottom 0.254: v35.56,11.68 v21.46,25.78
N$6
  Top 0.254: R2.1 19.05,21.84 21.59,21.84 23.27,20.16 FT232RL.1
N$7
  Top 0.254: R3.1 39.37,7.55 39.37,6.6 37.05,4.28 PWR.A
N$8
  Top 0.254: FT232RL.5 20.68,20.22 20.32,20.57 17.78,20.57 16.51,21.84 R5.1
N$10  (via drill 0.51)
  Top 0.254: FT232RL.22 19.38,13.79 v20.32,14.73 | v31.11,6.35 31.11,5.3 31.97,4.45 RX.C
  Bottom 0.254: v20.32,14.73 26.54,14.73 31.11,9.78 v31.11,6.35
N$11
  Top 0.254: R7.1 34.07,7.77 RX.A
N$12  (via drill 0.51)
  Top 0.254: FT232RL.23 20.02,13.45 20.42,13.84 v22.86,13.84 | 27.94,4.32 27.94,4.28 | 27.94,4.28 26.04,6.19 v26.04,6.22 | 27.94,4.28 TX.C
  Bottom 0.254: v22.86,13.84 24.89,13.84 26.04,12.06 v26.04,6.22
N$13
  Top 0.254: TX.A 28.26,6.06 R6.1
N$14
  Top 0.254: ATMEGA1280.33 24.24,26.81 25.47,25.58 OSC.3
N$23
  Top 0.254: SD_L.A 39.47,25.87 R11.2
N$35  (via drill 0.4)
  other vias: 53.01,36.91
N$37  (via drill 0.4)
  other vias: 52.5,49.02
N$58  (via drill 0.4)
  other vias: 50.5,49.02
N$59  (via drill 0.4)
  other vias: 48.5,49.02
N$61  (via drill 0.4)
  other vias: 50,50.52
N$69
  Top 0.254: R13.2 32.99,49.52 34.2,49.52 35.08,48.65 ACS711.6
N$70  (via drill 0.4)
  other vias: 52,51.52
RAW
  Top 0.254: 2.54,20.9 AP1117.3 | 20.78,49.56 R14.1
  Top 0.305: 20.78,49.56 20.78,49.86 22.23,51.31 22.23,52.96 20.32,54.86 17.67,54.86 17.56,54.76
  Top 1.422: 3.07,54.86 17.51,54.86 17.56,54.76 BANCO.3
  Top 1.5: 1.78,10.06 1.78,18.92 2.77,19.91 AP1117.3 2.77,21.93 1.27,23.43 1.27,53.07 arc-90 3.07,54.86 | 1.78,10.06 C4.1 | 1.78,10.06 7.54,10.06 9.23,11.75 J1.2
RST  (via drill 0.51)
  Top 0.254: ISP.5 48.01,32.77 46.74,34.04 43.94,34.04 42.42,32.38 v42.42,22.23 42.29,22.23 41.91,21.84 28.26,21.84 R8.1 25.45,21.52 C2.1 22.74,24.23 ATMEGA1280.30 | S1.P$2 46.99,8.23 v46.99,11.68
  Bottom 0.254: v42.42,22.23 46.61,22.23 46.99,21.84 v46.99,11.68
RX_FT232  (via drill 0.51)
  Top 0.254: R5.2 16.51,25.02 v17.33,25.96 | v22.86,37.5 22.86,37.66 20.8,39.72 20.8,40.48 20.47,40.81 ATMEGA1280.3
  Bottom 0.254: v22.86,37.5 22.86,32.13 v17.33,25.96
SCK  (via drill 0.51, 0.6)
  Top 0.254: MICROSD.5 43.72,14.95 42.45,16.22 36.7,16.22 v36.83,16.26 36.64,16.26 35.18,16.26 | ATMEGA1280.20 20.25,32.31 21.08,32.38 27.3,32.38 27.89,31.92 v28.4,31.92 | ISP.3 49.53,31.24 49.53,33.27 48.13,34.67 43.43,34.67 39.37,30.73 R11.1 39.3,27.94 v36.83,27.94
  Top 0.406: 35.18,16.26 35.05,16.38
  Bottom 0.254: v28.4,31.92 30.56,31.92 34.54,27.94 v36.83,27.94 v36.83,16.26 39.37,16.26 39.75,15.62
  Bottom 0.406: 39.75,14.71 39.75,15.62
SCL  (via drill 0.6)
  Top 0.305: v33.15,24.38 30.48,24.38 29.21,25.65 29.21,27.78 ATMEGA1280.43 29.21,27.84 29.21,28.96 28.7,29.46 v25.4,29.46 | R10.2 34.22,16.38 v35.05,16.38 35.05,13.46 35.56,12.95 v38.1,12.95
  Top 0.406: DS3231.16 15.88,35.18 v16.51,34.54 | v21.59,34.54 v25.02,34.54
  Bottom 0.305: v25.02,34.54 25.02,29.85 | v38.1,12.95 39.24,12.95 39.5,13.21 39.5,13.72 39.7,13.91 TEMP.2
  Bottom 0.406: v35.05,16.38 33.53,17.91 34.04,18.8 34.04,23.5 v33.15,24.38 | v16.51,34.54 v21.59,34.54 | 25.02,29.85 v25.4,29.46
SDA  (via drill 0.51, 0.6)
  Top 0.254: v31.62,11.18 30.8,12 R16.2
  Top 0.305: ATMEGA1280.44 29.74,26.39 v30.48,25.65
  Top 0.406: v30.48,20.57 30.48,18.03 v29.21,16.76 | v29.21,12.95 R16.2 | DS3231.15 14.61,33.91 15.24,33.27 15.24,30.48 16.38,29.34 v16.51,29.46
  Bottom 0.254: TEMP.1 40.34,12.66 38.48,10.41 32.38,10.41 v31.62,11.18
  Bottom 0.406: v30.48,25.65 30.48,23.11 | 30.48,23.11 v30.48,20.57 | v29.21,16.76 v29.21,12.95 | v16.51,29.46 16.51,24.38 17.02,23.88 20.07,23.88 20.32,24.13 20.32,26.16 21.08,26.92 27.94,26.92 28.32,26.54 28.32,25.15 30.35,23.11 30.48,23.11
SENSOR_CURRENT  (via drill 0.4, 0.6)
  Top 0.254: ACS711.7 35.66,47.38 33.95,45.67 v24.55,45.67 | ATMEGA1280.97 22.24,42.78 23.11,41.91 23.87,41.91 v23.92,41.99
  Bottom 0.254: v23.92,41.99 23.92,45.04 v24.55,45.67
SENSOR_VOLT
  Top 0.254: ATMEGA1280.96 22.74,47.54 R15.2 R14.2
TX_FT232  (via drill 0.51, 0.6)
  Top 0.254: R2.2 v19.05,26.16 | ATMEGA1280.2 20.81,41.31 v22.8,39.32
  Bottom 0.254: v19.05,26.16 24.13,32 24.13,38.72 23.53,39.32 v22.8,39.32
USB_D+1  (via drill 0.6)
  Top 0.305: v14.86,6.6 14.82,7.02 FT232RL.15
  Bottom 0.305: v14.86,6.6 15.62,6.22 19.3,6.22 19.56,6.48 21.46,6.48 22.86,7.87 22.86,9.91 22.23,10.54 19.56,10.54 X1.D+
USB_D-1
  Top 0.305: X1.D- 16.93,8.09 15.49,9.53 15.49,11.82 FT232RL.16
VCC1  (via drill 0.5)
  Top 0.305: C9.A 7.75,7.87 C3.1 v13.97,7.87 | FT232RL.20 18.07,9.41 X1.VBUS
  Bottom 0.305: v13.97,7.87 16.54,7.87 X1.VBUS

### Text on the board
tNames: - | + | V1 1448